# Altium schematic sheet Teensy_IOexp_valve_transitors.SchDoc
size A; SheetNumber: 2; SheetTotal: 7
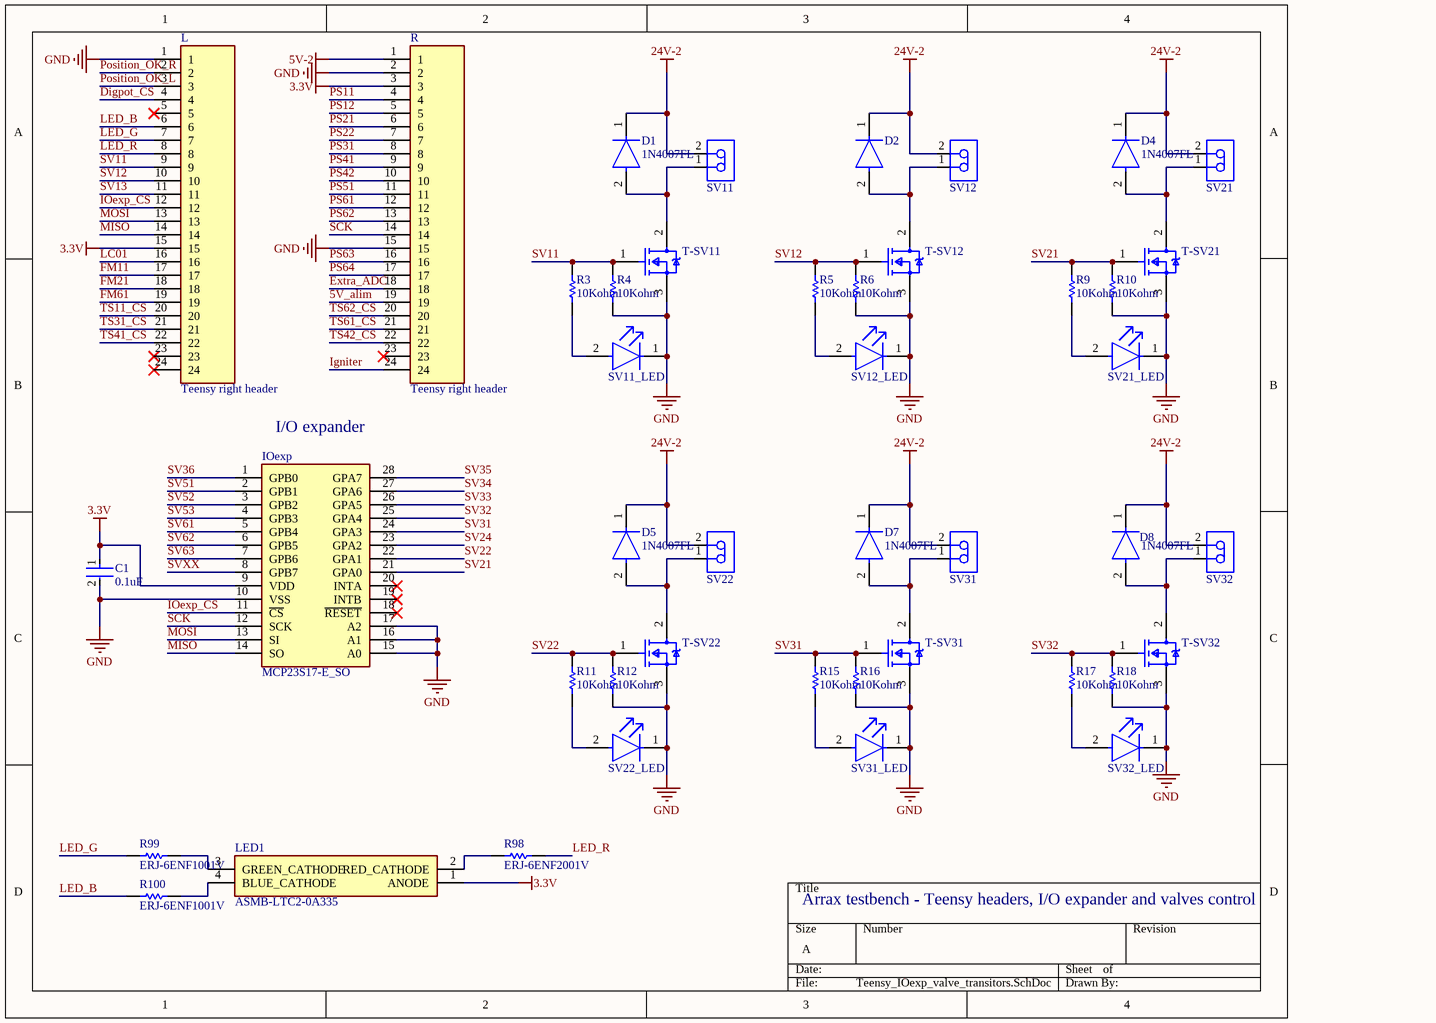
[diagram p0: Teensy_IOexp_valve_transitors.SchDoc]

## Parts
C1  0.1uF  [FP-CC0805-0_85-MFG]
D1  1N4007FL  [FP-1N4007FL-MFG]
D2  1N4007FL  [FP-1N4007FL-MFG]  (value not drawn)
D4  1N4007FL  [FP-1N4007FL-MFG]
D5  1N4007FL  [FP-1N4007FL-MFG]
D7  1N4007FL  [FP-1N4007FL-MFG]
D8  1N4007FL  [FP-1N4007FL-MFG]
IOexp  MCP23S17-E_SO  [SOIC127P1030X265-28N]
L  Teensy right header  [RHDR24W80P254X254_1X24_6146X254X850P]
LED1  ASMB-LTC2-0A335  [ASMBLTC20A335]
R  Teensy right header  [RHDR24W80P254X254_1X24_6146X254X850P]
R3  10Kohm  [RESC2013X60X30NL20T20]
R4  10Kohm  [RESC2013X60X30NL20T20]
R5  10Kohm  [RESC2013X60X30NL20T20]
R6  10Kohm  [RESC2013X60X30NL20T20]
R9  10Kohm  [RESC2013X60X30NL20T20]
R10  10Kohm  [RESC2013X60X30NL20T20]
R11  10Kohm  [RESC2013X60X30NL20T20]
R12  10Kohm  [RESC2013X60X30NL20T20]
R15  10Kohm  [RESC2013X60X30NL20T20]
R16  10Kohm  [RESC2013X60X30NL20T20]
R17  10Kohm  [RESC2013X60X30NL20T20]
R18  10Kohm  [RESC2013X60X30NL20T20]
R98  ERJ-6ENF2001V  [RESC2013X70X40NL20T20]
R99  ERJ-6ENF1001V  [RESC2013X70X40ML20T20]
R100  ERJ-6ENF1001V  [RESC2013X70X40ML20T20]
SV11  640456-2  [TECO-640456-2_V]  (value not drawn)
SV11_LED  LS R976-NR-1  [FP-LS_R976-MFG]  (value not drawn)
SV12  640456-2  [TECO-640456-2_V]  (value not drawn)
SV12_LED  LS R976-NR-1  [FP-LS_R976-MFG]  (value not drawn)
SV21  640456-2  [TECO-640456-2_V]  (value not drawn)
SV21_LED  LS R976-NR-1  [FP-LS_R976-MFG]  (value not drawn)
SV22  640456-2  [TECO-640456-2_V]  (value not drawn)
SV22_LED  LS R976-NR-1  [FP-LS_R976-MFG]  (value not drawn)
SV31  640456-2  [TECO-640456-2_V]  (value not drawn)
SV31_LED  LS R976-NR-1  [FP-LS_R976-MFG]  (value not drawn)
SV32  640456-2  [TECO-640456-2_V]  (value not drawn)
SV32_LED  LS R976-NR-1  [FP-LS_R976-MFG]  (value not drawn)
T-SV11  IRLZ44NPbF  [FP-PG-TO220-3-MFG]  (value not drawn)
T-SV12  IRLZ44NPbF  [FP-PG-TO220-3-MFG]  (value not drawn)
T-SV21  IRLZ44NPbF  [FP-PG-TO220-3-MFG]  (value not drawn)
T-SV22  IRLZ44NPbF  [FP-PG-TO220-3-MFG]  (value not drawn)
T-SV31  IRLZ44NPbF  [FP-PG-TO220-3-MFG]  (value not drawn)
T-SV32  IRLZ44NPbF  [FP-PG-TO220-3-MFG]  (value not drawn)

## Nets
3.3V: C1.1 IOexp.9(VDD) L.15 LED1.1(ANODE) R.3
5V-2: R.1
24V-2: D1.1(C) D2.1(C) D4.1(C) D5.1(C) D7.1(C) D8.1(C) SV11.2 SV12.2 SV21.2 SV22.2 SV31.2 SV32.2
GND: C1.2 IOexp.10(VSS) IOexp.15(A0) IOexp.16(A1) IOexp.17(A2) L.1 R.2 R.15 R4.1 R6.1 R10.1 R12.1 R16.1 R18.1 SV11_LED.1(C) SV12_LED.1(C) SV21_LED.1(C) SV22_LED.1(C) SV31_LED.1(C) SV32_LED.1(C) T-SV11.3(S) T-SV12.3(S) T-SV21.3(S) T-SV22.3(S) T-SV31.3(S) T-SV32.3(S)
5V_alim: R.19
Digpot_CS: L.4
Extra_ADC: R.18
FM11: L.17
FM21: L.18
FM61: L.19
Igniter: R.24
IOexp_CS: IOexp.11(~{CS}) L.12
LC01: L.16
LED_B: L.6 R100.1
LED_G: L.7 R99.1
LED_R: L.8 R98.2
MISO: IOexp.14(SO) L.14
MOSI: IOexp.13(SI) L.13
Position_OK_L: L.3
Position_OK_R: L.2
PS11: R.4
PS12: R.5
PS21: R.6
PS22: R.7
PS31: R.8
PS41: R.9
PS42: R.10
PS51: R.11
PS61: R.12
PS62: R.13
PS63: R.16
PS64: R.17
SCK: IOexp.12(SCK) R.14
SV11: L.9 R3.2 R4.2 T-SV11.1(G)
SV12: L.10 R5.2 R6.2 T-SV12.1(G)
SV13: L.11
SV21: IOexp.21(GPA0) R9.2 R10.2 T-SV21.1(G)
SV22: IOexp.22(GPA1) R11.2 R12.2 T-SV22.1(G)
SV24: IOexp.23(GPA2)
SV31: IOexp.24(GPA3) R15.2 R16.2 T-SV31.1(G)
SV32: IOexp.25(GPA4) R17.2 R18.2 T-SV32.1(G)
SV33: IOexp.26(GPA5)
SV34: IOexp.27(GPA6)
SV35: IOexp.28(GPA7)
SV36: IOexp.1(GPB0)
SV51: IOexp.2(GPB1)
SV52: IOexp.3(GPB2)
SV53: IOexp.4(GPB3)
SV61: IOexp.5(GPB4)
SV62: IOexp.6(GPB5)
SV63: IOexp.7(GPB6)
SVXX: IOexp.8(GPB7)
TS11_CS: L.20
TS31_CS: L.21
TS41_CS: L.22
TS42_CS: R.22
TS61_CS: R.21
TS62_CS: R.20
NetD1_2: D1.2(A) SV11.1 T-SV11.2(D)
NetD2_2: D2.2(A) SV12.1 T-SV12.2(D)
NetD4_2: D4.2(A) SV21.1 T-SV21.2(D)
NetD5_2: D5.2(A) SV22.1 T-SV22.2(D)
NetD7_2: D7.2(A) SV31.1 T-SV31.2(D)
NetD8_2: D8.2(A) SV32.1 T-SV32.2(D)
NetLED1_2: LED1.2(RED_CATHODE) R98.1
NetLED1_3: LED1.3(GREEN_CATHODE) R99.2
NetLED1_4: LED1.4(BLUE_CATHODE) R100.2
NetR3_1: R3.1 SV11_LED.2(A)
NetR5_1: R5.1 SV12_LED.2(A)
NetR9_1: R9.1 SV21_LED.2(A)
NetR11_1: R11.1 SV22_LED.2(A)
NetR15_1: R15.1 SV31_LED.2(A)
NetR17_1: R17.1 SV32_LED.2(A)

Not connected (* = marked no-connect by the designer): IOexp 18(~{RESET})* 19(INTB)* 20(INTA)*; L 5* 23* 24*; R 23*

## Notes on the sheet
- I/O expander
- Arrax testbench - Teensy headers, I/O expander and valves control

## Library data of the parts
C1 = CMP-2100-03606-3: CAP CER 0.1UF 50V X7R 0805; Manufacturer Part Number: CC0805KRX7R9BB104; Manufacturer: Yageo; Tolerance: 0.1; Capacitance: 100 nF; Value: 100 nF; Material: Ceramic; Device Class L1: Passive Components; ComponentLink2Description: Datasheet; Package: CC0805-0.85; Digikey Description: CAP CER 0.1UF 50V X7R 0805; Device Class L3: Ceramic Capacitors; Temperature: -30°C to +85°C; Temperature Characteristic: X7R; Voltage Rating: 50 V; Height: 0.95mm; RoHS: TRUE; Ipc Land Pattern Name: CAPC200125X85; Device Class L2: Capacitors; Category: Cap; Temperature Range Low: -30°C; Temperature Range High: +85°C; Mouser Description: Multilayer Ceramic Capacitors MLCC - SMD/SMT 100nF 50V X7R 10%; Footprint Url: http://www.yageo.com/exep/pages/download/literatures/UPY-C_GEN_24.pdf; Automotive: No; Octopart: https://octopart.com/cc0805krx7r9bb104-yageo-192993; Lead Free: Yes; ComponentLink2URL: http://www.yageo.com/documents/recent/UPY-GPHC_Y5V_6.3V-to-50V_8.pdf
D1 D2 D4 D5 D7 D8 = CMP-10078-122641204-1: 1N4007FL Diode Gen Purp 1KV 1A SOD123FL; Capacitance: 6pF; Max Junction Temperature (Tj): 150°C; Peak Reverse Current: 5µA; Max Forward Surge Current (Ifsm): 30A; Reverse Voltage: 1kV; Max Operating Temperature: 150°C; Height: 1.1mm; Min Operating Temperature: -55°C; Forward Current: 1A; Max Repetitive Reverse Voltage (Vrrm): 1kV; NexarPartId: 122641204
IOexp = MCP23S17-E_SO: Integrated Circuit; Manufacturer_Name: Microchip; Manufacturer_Part_Number: MCP23S17-E/SO; Datasheet Link: https://datasheet.datasheetarchive.com/originals/distributors/SFDatasheet-4/sf-00090057.pdf; Height: 2.65mm; Mouser Part Number: 579-MCP23S17-E/SO; Mouser Price/Stock: https://www.mouser.co.uk/ProductDetail/Microchip-Technology/MCP23S17-E-SO?qs=usxtMOJb1RzJScThsWtScg%3D%3D; Arrow Part Number: MCP23S17-E/SO; Arrow Price/Stock: https://www.arrow.com/en/products/mcp23s17-eso/microchip-technology?region=europe
L R = PPTC241LFBN-RC: Connector; Manufacturer_Name: Sullins; Datasheet Link: https://drawings-pdf.s3.amazonaws.com/10492.pdf; Height: 8.5mm; Manufacturer_Part_Number: PPTC241LFBN-RC
LED1 = ASMB-LTC2-0A335: LED; Manufacturer_Name: Avago Technologies; Datasheet Link: https://datasheet.datasheetarchive.com/originals/distributors/Datasheets_SAMA/7bf4059288332b456b15eab80a49c995.pdf; Height: 1.2mm; Manufacturer_Part_Number: ASMB-LTC2-0A335
R3-R6 R9-R12 R15-R18 = CMP-2001-01994-1: Manufacturer: KOA Speer; Part Number: RK73H2ATTD1003F
R98 = CMP-2001-00026-5: Chip Resistor, 2 KOhm, +/- 1%, 0.125 W, -55 to 155 degC, 0805 (2012 Metric), RoHS, Tape and Reel; Manufacturer: Panasonic; Voltage Rating: 150 V; RoHSCompliant: true; Packaging: Tape and Reel; ComponentLink2Description: Datasheet; DatasheetVersion: 04/2015; Min Operating Temperature: -55 degC; Max Operating Temperature: 155 degC; Mounting Technology: Surface Mount; Length: 2 mm; Package Quantity: 5000; REACH SVHC: Unknown; ComponentLink1URL: http://www.panasonic.com/; ComponentLink2URL: http://industrial.panasonic.com/cdbs/www-data/pdf/RDA0000/AOA0000C86.pdf; Mount: Surface Mount; PackageReference: 0805; ComponentLink1Description: Manufacturer URL; PackageDescription: 2-Pin Surface Mount Device, Body 2 x 1.25 mm; Height: 0.6 mm
R99 R100 = CMP-2001-04375-5: Chip Resistor, 1 KOhm, +/- 1%, 0.125 W, -55 to 155 degC, 0805 (2012 Metric), RoHS, Tape and Reel; Manufacturer: Panasonic; Voltage Rating: 150 V; ComponentLink1URL: http://www.panasonic.com/; ComponentLink2Description: Datasheet; REACH SVHC: Yes; ComponentLink1Description: Manufacturer URL; Length: 2 mm; Height: 0.6 mm; Package Quantity: 1; PackageDescription: 2-Pin Surface Mount Device, Body 2 x 1.25 mm; Packaging: Cut Tape; PackageReference: 0805; Max Operating Temperature: 155 degC; Mounting Technology: Surface Mount; ComponentLink2URL: http://industrial.panasonic.com/cdbs/www-data/pdf/RDA0000/AOA0000C86.pdf; DatasheetVersion: 04/2015; Min Operating Temperature: -55 degC; RoHSCompliant: true; Mount: Surface Mount
SV11 SV12 SV21 SV22 SV31 SV32 = CMP-2000-05417-1: Male Header, Pitch 2.54 mm, 1 x 2 Position, Height 10.49 mm, Tail Length 3.556 mm, -55 to 105 degC, RoHS, Bulk; Manufacturer: TE Connectivity; Standards: RoHSCompliant,ELVCompliant,UL94V-0; Material, Housing: Polyester; Agency Approvals: CSA,UL; Brand/Series: MTA-100Series; Contact Centerline Spacing: 0.100 / in.; Material, Contact: CopperAlloy; Current, Rating: 5 / A; Color, Housing: White; Contact Termination Area Plating: Tin; Special Features: Pinstrip; Number of Positions: 2; Pin Spacing: 0.1 / "; Temperature, Operating: -55to+105 / degC; Angle: Straight; Mount Angle: Vertical; Connector Type: MTA-100; Primary Type: InterconnectSystem; Voltage, Rating: 250 / V; Mounting Hole Size: 0.04 / "; Number of Rows: 1; Termination: Solder; Length, Terminal Post: 0.14 / in.; Manufacturer URL: http://www.te.com/; Color: White; Size, Post: 0.025 / in.; Contact Shape: Square; Mounting Type: PCMount; Datasheet URL: https://datasheet.ciiva.com/11746/0900766b80eb7fdd-11746365.pdf; Type: PCBPlug; Datasheet Version: Rev. W, 06/2004; Number of Contacts: 2; Flammability Rating: UL94V-0; Contact Plating: Tin; Length, Pin: 0.14 / "; Contact Mating Area Plating: Tin; Length, Overall: 0.2 / "
SV11_LED SV12_LED SV21_LED SV22_LED SV31_LED SV32_LED = CMP-62016-000037-1: LED RED DIFFUSED 0805 SMD; Lens Size: 1.25mm; Number of LEDs: 1; Luminous Intensity: 180mcd; Dominant Wavelength: 633nm; Lens Style: Flat; Reverse Voltage: 12V; Lens Color: White; Forward Voltage: 2.5V; Forward Current: 25mA; Power Dissipation: 65W; Luminous Flux: 0.47lm; Test Current: 20mA; Viewing Angle: 160°; Length: 2mm; Number of Pins: 2; Lens Transparency: Diffused; Min Operating Temperature: -30°C; Case Code (Metric): 2012; Depth: 1.35mm; Color: Red; Illumination Color: Red; Max Operating Temperature: 85°C; Mount: Surface Mount; Case/Package: 0805; Height: 0.9mm; Package Quantity: 16000; Number of Elements: 1; Radiation Hardening: No; Case Code (Imperial): 0805; Packaging: Tape and Reel; Width: 1.25mm
T-SV11 T-SV12 T-SV21 T-SV22 T-SV31 T-SV32 = CMP-32901-000488-1: MOSFET N-CH 55V 47A TO220AB; Turn-On Delay Time: 11ns; Gate to Source Voltage (Vgs): 16V; Element Configuration: Single; Rds On Max: 22mR; Turn-Off Delay Time: 26ns; Max Power Dissipation: 110W; Threshold Voltage: 2V; Drain to Source Resistance: 35mR; Input Capacitance: 1.7nF; Continuous Drain Current (ID): 47A; Case/Package: TO-220; Lead Free: Lead Free; Halogen Free: Halogen Free; Packaging: Rail/Tube; Length: 0.414inch; Min Operating Temperature: -55°C; REACH SVHC: No SVHC; Number of Pins: 3; Width: 0.185inch; Drain to Source Voltage (Vdss): 55V; Power Dissipation: 110W; RoHS Compliant: Yes; Max Operating Temperature: 175°C; Height: 0.6inch; Max Dual Supply Voltage: 55V; Drain to Source Breakdown Voltage: 55V; Mount: Through Hole